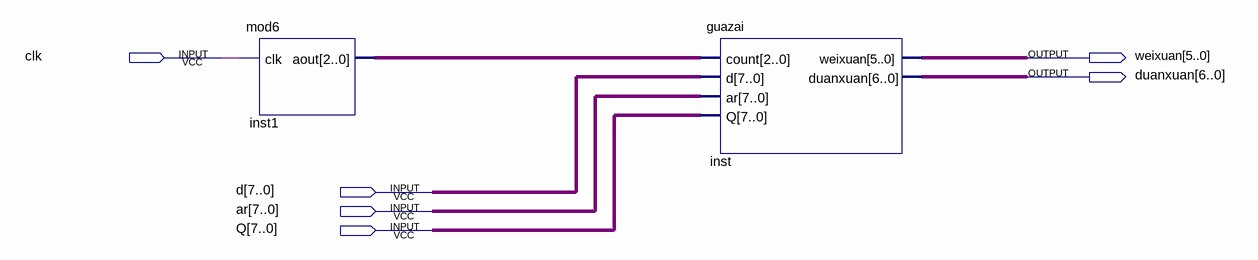
[diagram p0: schematic sheet]
// Quartus schematic xianshi.bdf as structural Verilog: 2 symbols, 6 pins
module xianshi (
  input  clk,
  input  [7:0] d,
  input  [7:0] ar,
  input  [7:0] Q,
  output [5:0] weixuan,
  output [6:0] duanxuan
);

  wire [2:0] inst1_aout;

  mod6 inst1 (.clk(clk), .aout(inst1_aout));
  guazai inst (.count(inst1_aout), .d(d), .ar(ar), .Q(Q), .weixuan(weixuan), .duanxuan(duanxuan));
endmodule
